# EAGLE schematic h2oiq_v3 (EAGLE 6.3)
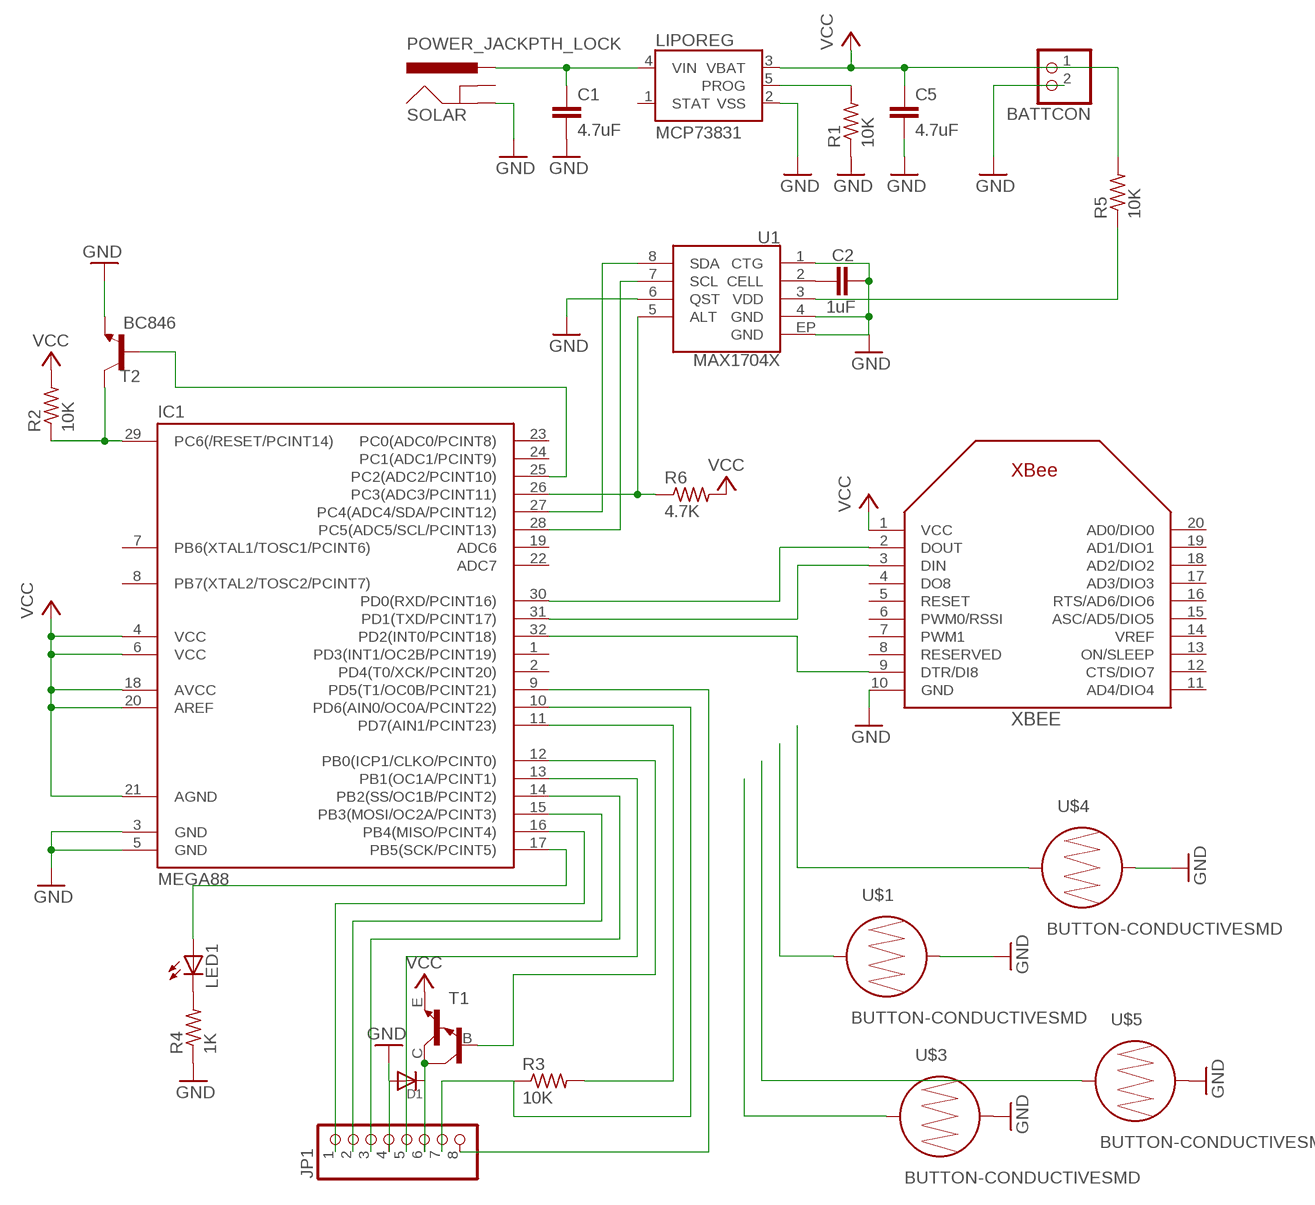
[diagram p0: schematic, sheet 1]

## Parts
BATTCON  JST_2PIN-SMT  [JST-PH-2-SMT]
C1  4.7uF  CAP0402-CAP  [0402-CAP]
C2  1uF  CAP0402-CAP  [0402-CAP]
C5  4.7uF  CAP0402-CAP  [0402-CAP]
D1  DIODESMA  [SMADIODE]
IC1  MEGA88  MEGA48/88/168-MU  [MLF32]
JP1  PINHD-1X8LOCK  [1X08-LOCK]
LED1  LED3MM  [LED3MM]
LIPOREG  MCP73831  [SOT23-5]
R1  10K  R-US_R0603  [R0603]
R2  10K  R-US_R0603  [R0603@1]
R3  10K  R-US_R0603  [R0603]
R4  1K  R-US_R0603  [R0603@1]
R5  10K  R-US_R0603  [R0603@1]
R6  4.7K  R-US_R0603  [R0603@1]
SOLAR  POWER_JACKPTH_LOCK  [POWER_JACK_PTH_LOCK]
T1  MMBTA13LT1-NPN_DARL-SOT23-BEC  [SOT23-BEC]
T2  BC846  [SOT23]
U1  MAX1704X  [TDFN-8]
U$1  BUTTON-CONDUCTIVESMD  [BUTTON-CONDUCTIVE]
U$3  BUTTON-CONDUCTIVESMD  [BUTTON-CONDUCTIVE]
U$4  BUTTON-CONDUCTIVESMD  [BUTTON-CONDUCTIVE]
U$5  BUTTON-CONDUCTIVESMD  [BUTTON-CONDUCTIVE]
XBEE  XBEE  [XBEE]

## Nets
GND: BATTCON.2 C1.2 C2.2 C5.2 D1.A JP1.4 LIPOREG.2(VSS) R1.1 R4.1 SOLAR.GND T2.2(E) U1.1(CTG) U1.4(GND) U1.6(QST) U1.EP(GND) U$1.2 U$3.2 U$4.2 U$5.2 XBEE.10(GND)
N$1: C1.1 LIPOREG.4(VIN) SOLAR.PWR
N$2: LIPOREG.5(PROG) R1.2
N$3: IC1.29(PC6(/RESET/PCINT14)) R2.1 T2.3(C)
N$4: IC1.12(PB0(ICP1/CLKO/PCINT0)) T1.B
N$5: D1.C JP1.6 T1.C
N$6: IC1.27(PC4(ADC4/SDA/PCINT12)) U1.8(SDA)
N$7: IC1.28(PC5(ADC5/SCL/PCINT13)) U1.7(SCL)
N$8: IC1.32(PD2(INT0/PCINT18)) XBEE.9(DTR/DI8)
N$9: IC1.15(PB3(MOSI/OC2A/PCINT3)) JP1.2
N$10: IC1.17(PB5(SCK/PCINT5)) LED1.A
N$11: LED1.K(C) R4.2
N$12: U$4.1
N$13: IC1.14(PB2(SS/OC1B/PCINT2)) JP1.3
N$14: IC1.16(PB4(MISO/PCINT4)) JP1.1
N$15: IC1.10(PD6(AIN0/OC0A/PCINT22)) JP1.7 R3.1
N$16: IC1.26(PC3(ADC3/PCINT11)) R6.1 U1.5(ALT)
N$17: IC1.30(PD0(RXD/PCINT16)) XBEE.2(DOUT)
N$18: U$1.1
N$19: IC1.31(PD1(TXD/PCINT17)) XBEE.3(DIN)
N$20: U$5.1
N$21: U$3.1
N$23: C2.1 U1.2(CELL)
N$24: R5.1 U1.3(VDD)
N$26: IC1.13(PB1(OC1A/PCINT1)) JP1.5
N$27: IC1.11(PD7(AIN1/PCINT23)) R3.2
N$28: IC1.9(PD5(T1/OC0B/PCINT21)) JP1.8
N$29: IC1.25(PC2(ADC2/PCINT10)) T2.1(B)
VCC: BATTCON.1 C5.1 IC1.4(VCC) IC1.6(VCC) IC1.18(AVCC) LIPOREG.3(VBAT) R2.2 R5.2 R6.2 T1.E XBEE.1(VCC)
Unconnected: IC1.1(PD3(INT1/OC2B/PCINT19)) IC1.2(PD4(T0/XCK/PCINT20)) IC1.7(PB6(XTAL1/TOSC1/PCINT6)) IC1.8(PB7(XTAL2/TOSC2/PCINT7)) IC1.19(ADC6) IC1.20(AREF) IC1.22(ADC7) IC1.23(PC0(ADC0/PCINT8)) IC1.24(PC1(ADC1/PCINT9)) LIPOREG.1(STAT) SOLAR.GNDBREAK XBEE.4(DO8) XBEE.5(RESET) XBEE.6(PWM0/RSSI) XBEE.7(PWM1) XBEE.8(RESERVED) XBEE.11(AD4/DIO4) XBEE.12(CTS/DIO7) XBEE.13(ON/SLEEP) XBEE.14(VREF) XBEE.15(ASC/AD5/DIO5) XBEE.16(RTS/AD6/DIO6) XBEE.17(AD3/DIO3) XBEE.18(AD2/DIO2) XBEE.19(AD1/DIO1) XBEE.20(AD0/DIO0)

## Power pins joined to a net without a drawn wire
AGND: IC1.21(AGND)
GND: IC1.3(GND) IC1.5(GND)

## Library data of the parts
BATTCON = adafruit:JST_2PIN: JST 2-Pin Connectors of various flavors SMT-RA (S2B-PH-SM4) 4UConnector #17311 SMT (B2B-PH-SM4) THM-RA (S2B-PH) THM (B2B-PH)
C1 C2 C5 = SparkFun:CAP: Capacitor Standard 0603 ceramic capacitor, and 0.1" leaded capacitor.
D1 = adafruit:DIODE: Diode SMADIODE - SMA Surface Mount Package 20V 1A Schottky Diode Digikey: 641-1014-6-ND DO-1N4148 - Through Hole Small Current Diode SOD-123 20V 1 A (.5mV Vf) Schottky Diode - Digikey: MBRX120TPMSCT-ND SOD-323 10V 570mA (.38mV Vf, 3ns) Schottky Diode - Digikey: ZLLS410CT-ND SOD-523 30V 30mA Schottky Diode (RB751S-40TE61) - Digikey: RB751S-40TE61CT-ND SOT23-R/W - SOT23 Package (R = Solder Paste/Reflow Ovens, W = Hand-Soldering) BAT54Film 40V 300mA - Digikey: 497-7162-1-ND
IC1 = avr-7:MEGA48/88/168
JP1 = adafruit:PINHD-1X8: PIN HEADER
LED1 = adafruit:LED: LED OSRAM: - CHIPLED LG R971, LG N971, LY N971, LG Q971, LY Q971, LO R971, LY R971 LH N974, LH R974 LS Q976, LO Q976, LY Q976 LO Q996 - Hyper CHIPLED LW Q18S LB Q993, LB Q99A, LB R99A - SideLED LS A670, LO A670, LY A670, LG A670, LP A670 LB A673, LV A673, LT A673, LW A673 LH A674 LY A675 LS A676, LA A676, LO A676, LY A676, LW A676 LS A679, LY A679, LG A679 - Hyper Micro SIDELED® LS Y876, LA Y876, LO Y876, LY Y876 LT Y87S - SmartLED LW L88C, LW L88S LB L89C, LB L89S, LG L890 LS L89K, LO L89K, LY L89K LS L896, LA L896, LO L896, LY L896 - TOPLED LS T670, LO T670, LY T670, LG T670, LP T670 LSG T670, LSP T670, LSY T670, LOP T670, LYG T670 LG T671, LOG T671, LSG T671 LB T673, LV T673, LT T673, LW T673 LH T674 LS T676, LA T676, LO T676, LY T676, LB T676, LH T676, LSB T676, LW T676 LB T67C, LV T67C, LT T67C, LS T67K, LO T67K, LY T67K, LW E67C LS E67B, LA E67B, LO E67B, LY E67B, LB E67C, LV E67C, LT E67C LW T67C LS T679, LY T679, LG T679 LS T770, LO T770, LY T770, LG T770, LP T770 LB T773, LV T773, LT T773, LW T773 LH T774 LS E675, LA E675, LY E675, LS T675 LS T776, LA T776, LO T776, LY T776, LB T776 LHGB T686 LT T68C, LB T68C - Hyper Mini TOPLED® LB M676 - Mini TOPLED Santana® LG M470 LS M47K, LO M47K, LY M47K Source: http://www.osram.convergy.de/
LIPOREG = SparkFun:MCP73831: Microchip's MCP73831 Miniature single cell, fully integrated Li-Ion, Li-polymer charge management controller http://ww1.microchip.com/downloads/en/DeviceDoc/21984a.pdf
R1 R3 = resistor:R-US_: RESISTOR, American symbol
R2 R4-R6 = rcl:R-US_: RESISTOR, American symbol
SOLAR = SparkFun:POWER_JACK: Power Jack This is the standard 5.5mm barrel jack for power. The PTH is the most common, proven, reliable, footprint. All others are experimental. The Slot footprint only works if the mill layer is transmitted to the PCB fab house so be warned. Spark Fun Electronics SKU : PRT-00119. Mating wall wart : TOL-00298 (and others)
T1 = transistor:*-NPN_DARL-: NPN Darlington Transistor
T2 = transistor:BC846: NPN TRANSISTOR
U1 = SparkFun:MAX1704X: MAX17043/MAX17044: Battery Fuel Guage (43 is 1cell, 44 is 2cell)
U$1 U$3-U$5 = SparkFun:BUTTON-CONDUCTIVE: Conductive Button Used with rubber key pads. This one was designed and proven to work with the PolyCase Key FOB enclosures.
XBEE = adafruit:XBEE